# Altium schematic sheet Conectores.SchDoc
size A4; SheetNumber: 5; SheetTotal: 8
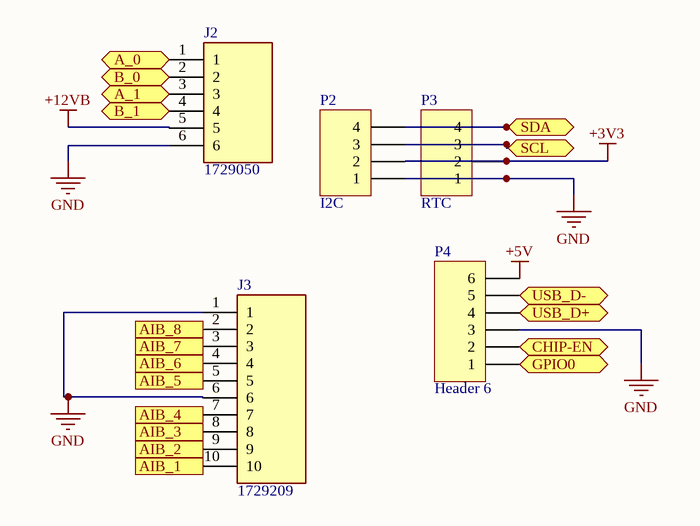
[diagram p0: Conectores.SchDoc]

## Parts
J2  1729050  [1729050]
J3  1729209  [1729209]
P2  I2C  [HDR1X4]
P3  RTC  [HDR1X4]
P4  Header 6  [HDR1X6]

## Ports
A_0 (bidir), A_1 (bidir), AIB_1 (out), AIB_2 (out), AIB_3 (out), AIB_4 (out), AIB_5 (out), AIB_6 (out), AIB_7 (out), AIB_8 (out), B_0 (bidir), B_1 (bidir), CHIP-EN (bidir), GPIO0 (bidir), SCL (bidir), SDA (bidir), USB_D+ (bidir), USB_D- (bidir)

## Nets
+3V3: P2.2 P3.2
+5V: P4.6
+12VB: J2.5
GND: J2.6 J3.1 J3.6 P2.1 P3.1 P4.3
A_0: J2.1 ; port A_0
A_1: J2.3 ; port A_1
AIB_1: J3.10 ; port AIB_1
AIB_2: J3.9 ; port AIB_2
AIB_3: J3.8 ; port AIB_3
AIB_4: J3.7 ; port AIB_4
AIB_5: J3.5 ; port AIB_5
AIB_6: J3.4 ; port AIB_6
AIB_7: J3.3 ; port AIB_7
AIB_8: J3.2 ; port AIB_8
B_0: J2.2 ; port B_0
B_1: J2.4 ; port B_1
CHIP-EN: P4.2 ; port CHIP-EN
GPIO0: P4.1 ; port GPIO0
SCL: P2.3 P3.3 ; port SCL
SDA: P2.4 P3.4 ; port SDA
USB_D+: P4.4 ; port USB_D+
USB_D-: P4.5 ; port USB_D-

## Library data of the parts
J2 = 1729050: Connector; Manufacturer_Name: Phoenix Contact; Datasheet Link: http://www.phoenixcontact.com/de/produkte/1729050/pdf; Height: 10.15mm; Manufacturer_Part_Number: 1729050; Mouser Part Number: 651-1729050; Mouser Price/Stock: https://www.mouser.co.uk/ProductDetail/Phoenix-Contact/1729050?qs=cq3Rj917t3laRrRfXpB0kg%3D%3D; Arrow Part Number: 1729050; Arrow Price/Stock: https://www.arrow.com/en/products/1729050/phoenix-contact?region=nac
J3 = 1729209: Connector; Manufacturer_Name: Phoenix Contact; Datasheet Link: http://www.phoenixcontact.com/de/produkte/1729209/pdf; Height: 10.15mm; Manufacturer_Part_Number: 1729209; Mouser Part Number: 651-1729209; Mouser Price/Stock: https://www.mouser.co.uk/ProductDetail/Phoenix-Contact/1729209?qs=DAHzmYU9cu26iNG3nw7bXQ%3D%3D
P2 P3 = Header 4: Header, 4-Pin; LatestRevisionDate: 17-Jul-2002; LatestRevisionNote: Re-released for DXP Platform.; Publisher: Altium Limited
P4 = Header 6: Header, 6-Pin; LatestRevisionDate: 17-Jul-2002; LatestRevisionNote: Re-released for DXP Platform.; Publisher: Altium Limited